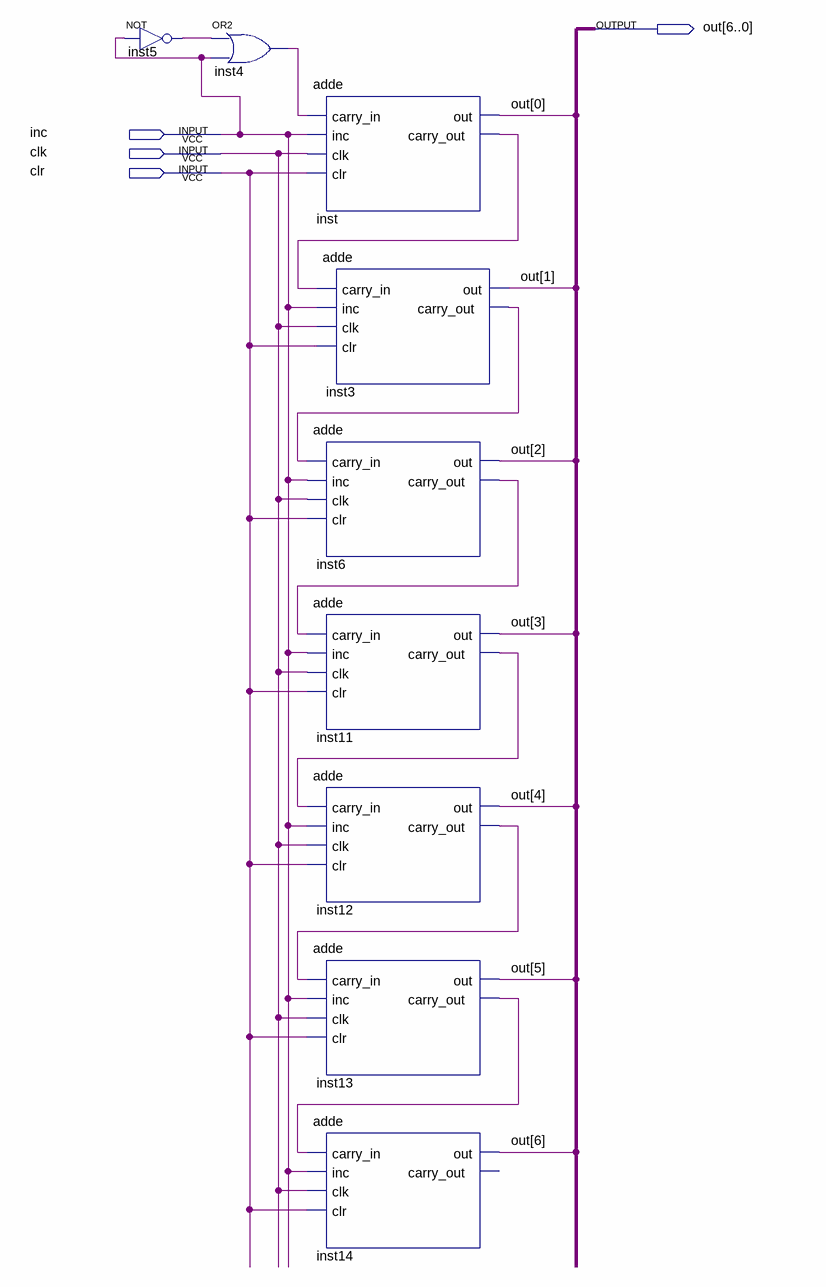
[diagram p0: schematic sheet]
// Quartus schematic add1.bdf as structural Verilog: 9 symbols, 4 pins
module add1 (
  input  inc,
  input  clk,
  input  clr,
  output [6:0] out
);

  wire inst3_carry_out, inst4_out, inst5_out, inst6_carry_out, inst11_carry_out, inst12_carry_out,
       inst13_carry_out, inst_carry_out;

  not inst5 (inst5_out, inc);
  or inst4 (inst4_out, inst5_out, inc);
  adde inst (.carry_in(inst4_out), .inc(inc), .clk(clk), .clr(clr), .out(out[0]), .carry_out(inst_carry_out));
  adde inst3 (.carry_in(inst_carry_out), .inc(inc), .clk(clk), .clr(clr), .out(out[1]), .carry_out(inst3_carry_out));
  adde inst6 (.carry_in(inst3_carry_out), .inc(inc), .clk(clk), .clr(clr), .out(out[2]), .carry_out(inst6_carry_out));
  adde inst11 (.carry_in(inst6_carry_out), .inc(inc), .clk(clk), .clr(clr), .out(out[3]), .carry_out(inst11_carry_out));
  adde inst12 (
    .carry_in(inst11_carry_out), .inc(inc), .clk(clk), .clr(clr), .out(out[4]), .carry_out(inst12_carry_out));
  adde inst13 (
    .carry_in(inst12_carry_out), .inc(inc), .clk(clk), .clr(clr), .out(out[5]), .carry_out(inst13_carry_out));
  adde inst14 (.carry_in(inst13_carry_out), .inc(inc), .clk(clk), .clr(clr), .out(out[6]));  // open: carry_out
endmodule
